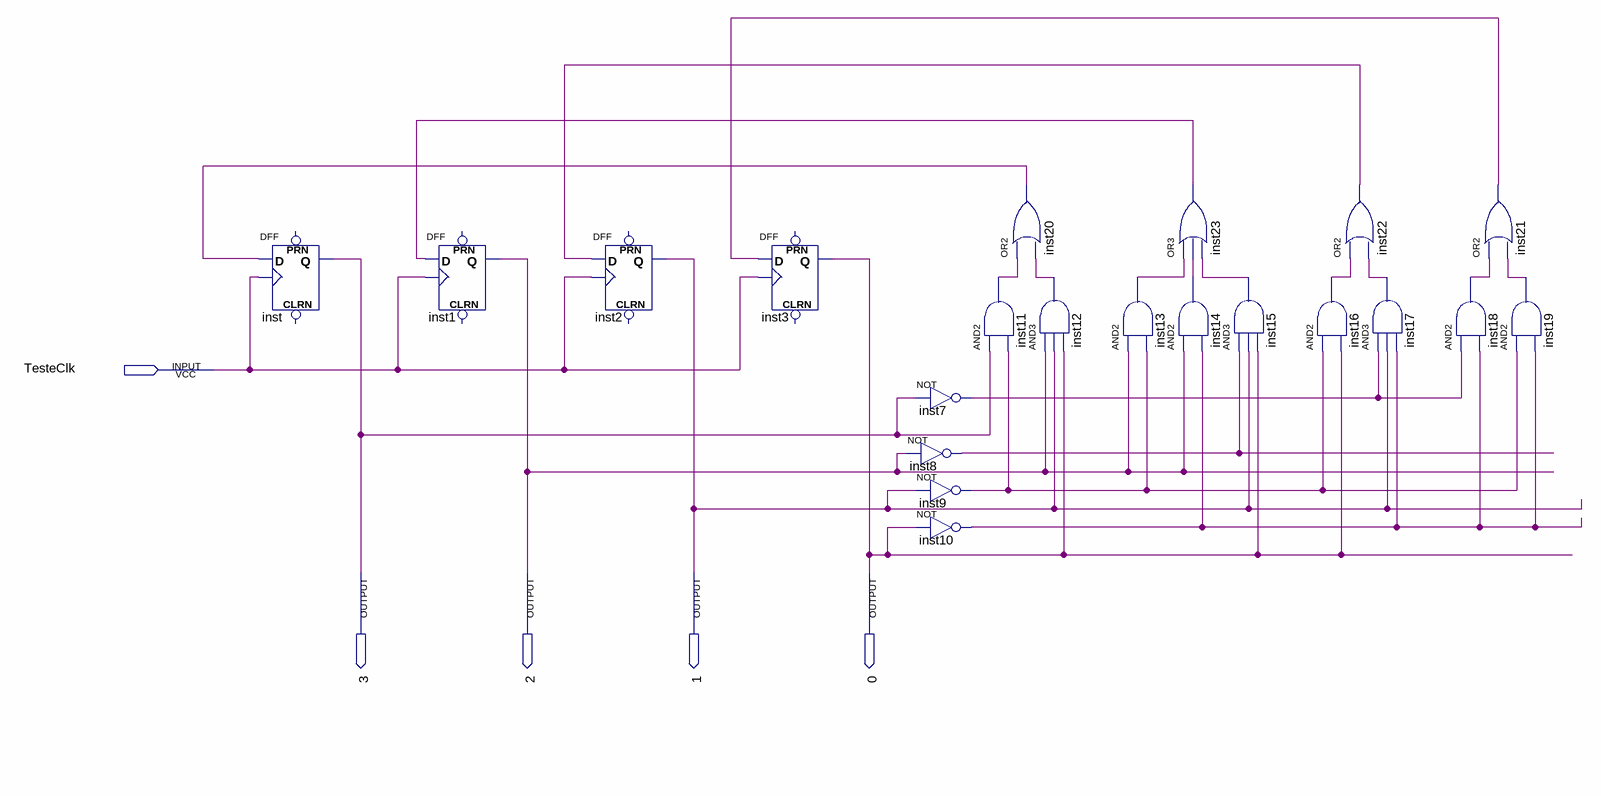
[diagram p0: schematic sheet]
// Quartus schematic Contador10.bdf as structural Verilog: 21 symbols, 5 pins
module Contador10 (
  input  TesteClk,
  output \3 ,
  output \2 ,
  output \1 ,
  output \0 
);

  wire inst7_out, inst8_out, inst9_out, inst10_out, inst11_out, inst12_out, inst13_out, inst14_out,
       inst15_out, inst16_out, inst17_out, inst18_out, inst19_out, inst20_out, inst21_out, inst22_out,
       inst23_out;

  DFF inst (.CLK(TesteClk), .D(inst20_out), .Q(\3 ));  // open: CLRN, PRN
  DFF inst1 (.CLK(TesteClk), .D(inst23_out), .Q(\2 ));  // open: CLRN, PRN
  DFF inst2 (.CLK(TesteClk), .D(inst22_out), .Q(\1 ));  // open: CLRN, PRN
  DFF inst3 (.CLK(TesteClk), .D(inst21_out), .Q(\0 ));  // open: CLRN, PRN
  not inst7 (inst7_out, \3 );
  not inst8 (inst8_out, \2 );
  not inst9 (inst9_out, \1 );
  not inst10 (inst10_out, \0 );
  or inst20 (inst20_out, inst11_out, inst12_out);
  and inst11 (inst11_out, \3 , inst9_out);
  and inst12 (inst12_out, \2 , \1 , \0 );
  and inst13 (inst13_out, \2 , inst9_out);
  or inst23 (inst23_out, inst13_out, inst14_out, inst15_out);
  and inst14 (inst14_out, \2 , inst10_out);
  and inst15 (inst15_out, inst8_out, \1 , \0 );
  or inst22 (inst22_out, inst16_out, inst17_out);
  and inst16 (inst16_out, inst9_out, \0 );
  and inst17 (inst17_out, inst7_out, \1 , inst10_out);
  or inst21 (inst21_out, inst18_out, inst19_out);
  and inst18 (inst18_out, inst7_out, inst10_out);
  and inst19 (inst19_out, inst9_out, inst10_out);
endmodule
